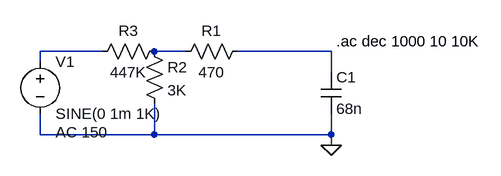
[diagram p0: schematic DraftRC.asc]
DraftRC.asc, the LTspice schematic file:
Version 4.1
SHEET 1 880 680
WIRE 16 96 -80 96
WIRE 144 96 96 96
WIRE 368 96 224 96
WIRE -80 112 -80 96
WIRE 368 128 368 96
WIRE -80 224 -80 192
WIRE 96 224 96 176
WIRE 96 224 -80 224
WIRE 368 224 368 192
WIRE 368 224 96 224
WIRE 368 240 368 224
FLAG 368 240 0
SYMBOL cap 352 128 R0
SYMATTR InstName C1
SYMATTR Value 68n
SYMBOL res 240 80 R90
WINDOW 0 0 56 VBottom 2
WINDOW 3 32 56 VTop 2
SYMATTR InstName R1
SYMATTR Value 470
SYMBOL res 80 80 R0
SYMATTR InstName R2
SYMATTR Value 3K
SYMBOL res 112 80 R90
WINDOW 0 0 56 VBottom 2
WINDOW 3 32 56 VTop 2
SYMATTR InstName R3
SYMATTR Value 447K
SYMBOL voltage -80 96 R0
WINDOW 123 24 124 Left 2
WINDOW 39 0 0 Left 0
SYMATTR Value2 AC 150
SYMATTR InstName V1
SYMATTR Value SINE(0 1m 1K)
TEXT 376 80 Left 2 !.ac dec 1000 10 10K

The netlist it stands for:
* DraftRC.asc
C1 N003 0 68n
R1 N003 N002 470
R2 N002 0 3K
R3 N002 N001 447K
V1 N001 0 SINE(0 1m 1K) AC 150
.ac dec 1000 10 10K
.backanno
.end